# Altium schematic sheet HI8596PSI.SchDoc
size 209 x 297 mm; Address1: Address1; Address2: Address2; Address3: Address3; Address4: Address4; SheetNumber: 1; Scale: 1:1; Разраб.: Иванов; Обозначение документа: АБВГ.123456.001 Э3; Пров.: Петров; Утв.: Сидоров; Наименование организации: ОАО "Концерн "МПО-Гидроприбор"; Перв. применение: АБВГ.123456.000; Наименование изделия 1: Плата; Наименование изделия 2: Схема электрическая; Наименование изделия 3: принципиальная; Нач. отд.: Нач. отд.; Фамилия нач. отд.: Сидоров
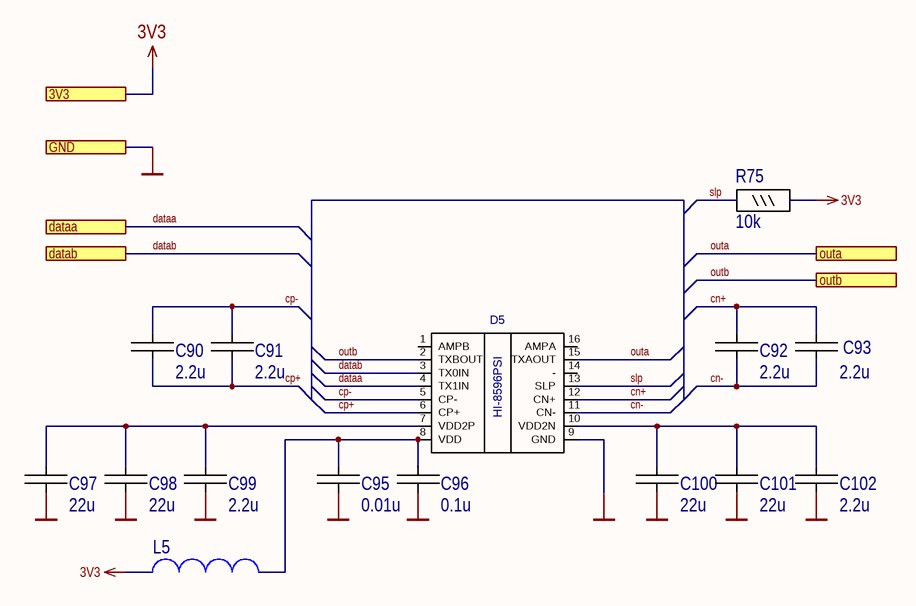
[diagram p0: HI8596PSI.SchDoc]

## Parts
C90  2.2u  [C0603_IPC]
C91  2.2u  [C0603_IPC]
C92  2.2u  [C0603_IPC]
C93  2.2u  [C0603_IPC]
C95  0.01u  [C0603_IPC]
C96  0.1u  [C0603_IPC]
C97  22u  [C1206_IPC]
C98  22u  [C1206_IPC]
C99  2.2u  [C0603_IPC]
C100  22u  [C1206_IPC]
C101  22u  [C1206_IPC]
C102  2.2u  [C0603_IPC]
D5  HI-8596PSI  [soic16]  (value not drawn)
L5  BLM21AG102SN1  [ind0805]  (value not drawn)
R75  10k  [R0603]

## Ports
3V3, dataa, datab, GND, outa, outb

## Nets
3V3: L5.1 R75.2 ; port 3V3
GND: C95.2 C96.2 C97.2 C98.2 C99.2 C100.2 C101.2 C102.2 D5.9(GND) ; port GND
cn+: C92.1 C93.1 D5.12(CN+)
cn-: C92.2 C93.2 D5.11(CN-)
cp+: C90.2 C91.2 D5.6(CP+)
cp-: C90.1 C91.1 D5.5(CP-)
dataa: D5.4(TX1IN) ; port dataa
datab: D5.3(TX0IN) ; port datab
outa: D5.15(TXAOUT) ; port outa
outb: D5.2(TXBOUT) ; port outb
slp: D5.13(SLP) R75.1
NetC95_1: C95.1 C96.1 D5.8(VDD) L5.2
NetC97_1: C97.1 C98.1 C99.1 D5.7(VDD2P)
NetC100_1: C100.1 C101.1 C102.1 D5.10(VDD2N)

Not connected (* = marked no-connect by the designer): D5 1(AMPB) 14(-) 16(AMPA)

## Notes on the sheet
- Перв. примен.
- Справ. №
- Подп. и дата
- Инв. № дубл.
- Взам. инв. №
- Разраб.
- Изм.
- Лист
- № докум.
- Подп.
- Дата
- Лит.
- Масса
- Масштаб
- Пров.
- Т.контр.
- Листов
- Инв. № подл.
- Утв.
- Н.контр.
- Копировал
- Формат А4

## Library data of the parts
C90-C93 C99 C102 = 2.2u 10V X7R: 2.2µF ±10% 10V Ceramic Capacitor X7R 0603 (1608 Metric); MPN: CL10B225KP8NNNC; Manufacturer: Samsung; Tolerance: 0,1; Name: 2.2u 10V X7R; Voltage/Power: 10V; LibraryPath: _library\sch\cap.schlib; FootprintPath: _library\pcb\capSmd.pcblib; ComponentLink2URL: https://www.digikey.com/product-detail/en/samsung-electro-mechanics/CL10B225KP8NNNC/1276-1134-2-ND/3886792; ComponentLink2Description: site; Type: X7R; price elitan 1000pc: 1.75; price terra 1000pc: 2.1; Value: 2.2u
C95 = 0.01u 50V: 0.01uF ±10% 50V Ceramic Capacitor X7R 0603 (1608 Metric); MPN: CC0603KRX7R9BB103; Manufacturer: Yageo; Tolerance: 0,1; Name: 0.01u 50V; Voltage/Power: 50V; LibraryPath: _library\sch\cap.schlib; FootprintPath: _library\pcb\capSmd.pcblib; ComponentLink2URL: https://www.digikey.com/product-detail/en/yageo/CC0603KRX7R9BB103/311-1085-2-ND/302819; ComponentLink2Description: site; Type: X7R; price elitan 1000pc: 0.54; price terra 1000pc: 0.62; Value: 0.01u
C96 = 0.1u 50V: 0.1uF ±10% 50V Ceramic Capacitor X7R 0603 (1608 Metric); MPN: CL10B104KB8NNND; Manufacturer: Samsung; Tolerance: 0,1; Name: 0.1u 50V; Voltage/Power: 50V; LibraryPath: _library\sch\cap.schlib; FootprintPath: _library\pcb\capSmd.pcblib; ComponentLink2URL: https://www.digikey.com/product-detail/en/yageo/CC0603KRX7R9BB104/311-1344-2-ND/2103082; ComponentLink2Description: site; Type: X7R; price elitan 1000pc: 0.63; price terra 1000pc: 0.65; Value: 0.1u
C97 C98 C100 C101 = 10u 50V: 10µF ±10% 50V Ceramic Capacitor X5R 1206 (3216 Metric); Manufacturer: Murata Electronics North America; Name: 22u 10V; Tolerance: 0,2; Voltage/Power: 10V; Type: X7R; MPN: https://www.digikey.com/product-detail/en/murata-electronics-north-america/GRM31CR71A226ME15L/490-6516-2-ND/2548199; Value: 22u; ComponentLink2URL: https://www.digikey.com/product-detail/en/murata-electronics-north-america/GRM31CR61H106KA12L/490-5961-2-ND/3693684capacitors/60?k=&pkeyword=&sv=0&pv2049=u4.7µF&pv14=4&sf=0&FV=fffc000d%2Cc0003%2C400006%2C440005%2C1f140000%2Cffe0003c&quantity=&ColumnSort=0&page=1&pageSize=25; ComponentLink2Description: site; price elitan 1000pc: 6.06; price terra 1000pc: 7.1; price chipdip 1000pc: 16; LibraryPath: _library\sch\cap.schlib; FootprintPath: _library\pcb\capSmd.pcblib
L5 = BLM21AG102: 1 kOhms @ 100MHz 1 Ferrite Bead 0805 (2012 Metric) 500mA 280 mOhm; Manufacturer: Murata Electronics North America; Value: 20mH, 1 kOhms @ 100MHz; Tolerance: ±25%; MPN: BLM21AG102SN1; Name: BLM21AG102; Voltage/Power: 500mA 280 mOhm; LibraryPath: _library\sch\inductors.schlib; FootprintPath: _library\pcb\inductor.pcblib; ComponentLink2URL: https://www.digikey.com/product-detail/en/murata-electronics-north-america/BLM21AG102SN1D/490-1041-2-ND/468922; ComponentLink2Description: site; price elitan 1000pc: 2.08; price terra 1000pc: 3.3; price chipdip 1000pc: 6; price dart 1000pc: 1.49
R75 = 10k 5%: 10 kOhms ±5% 0.1W, 1/10W Chip Resistor 0603 (1608 Metric) Moisture Resistant Thick Film; MPN: RC0603JR-0710kL; Manufacturer: yageo; Name: 10k 5%; Voltage/Power: 0.063; Value: 10k; Tolerance: 5%; ComponentLink2URL: https://www.digikey.com/product-detail/en/yageo/RC0603JR-0710KL/311-10KGRTR-ND/726700; ComponentLink2Description: site; price elitan 1000pc: 0.17; price terra 1000pc: 0.15; LibraryPath: sch\res.schlib; FootprintPath: pcb\resSmd.pcblib
D5 = HI-8596PSI: Value: *